# EAGLE design a210-4-band-eq (EAGLE 7.5.1)
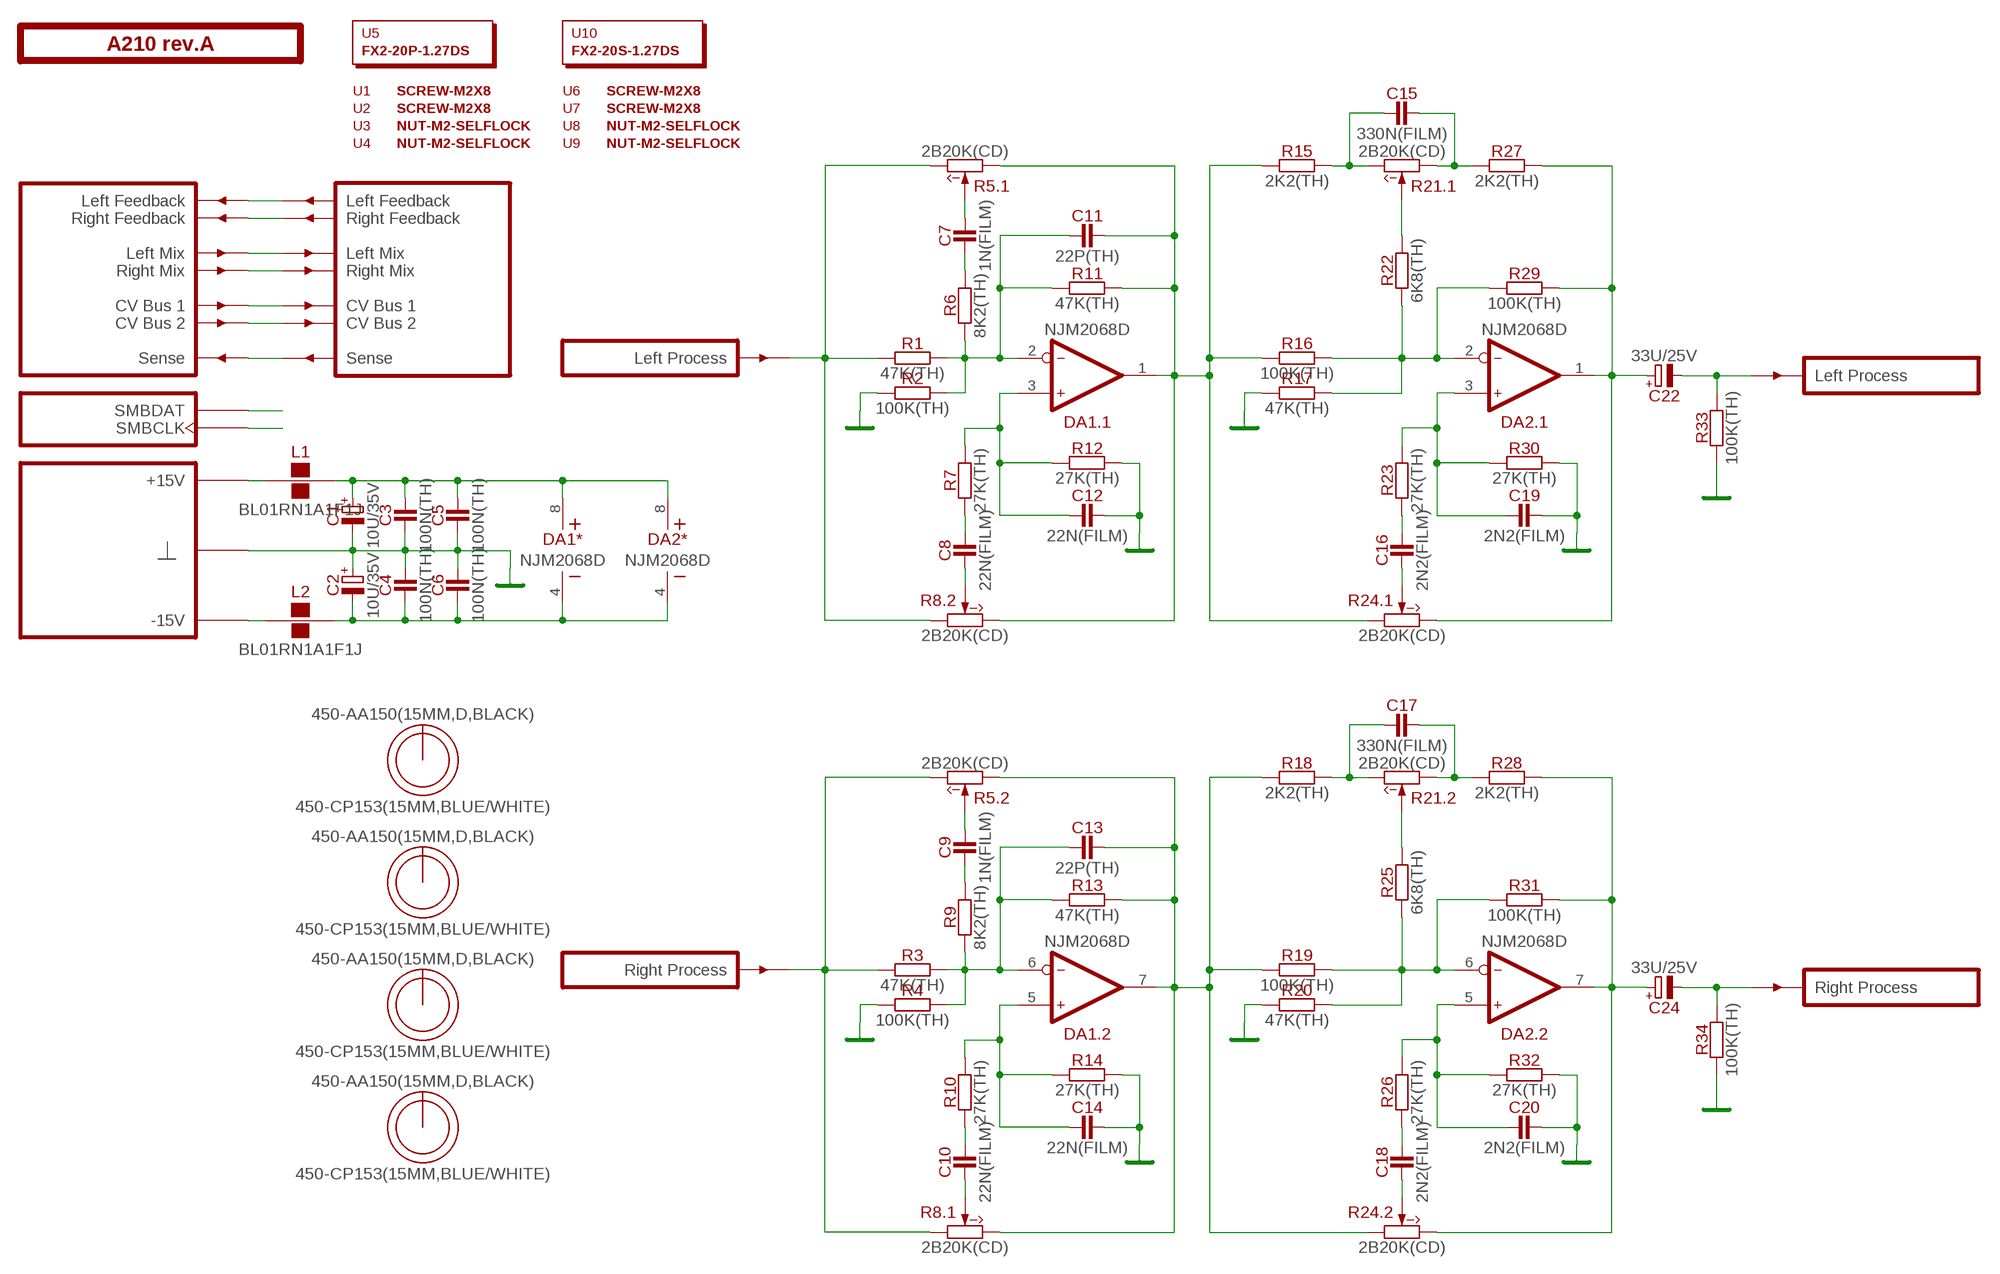
[diagram p0: schematic, sheet 1]

## Parts
C1  10U/35V  [E2-5]
C2  10U/35V  [E2-5]
C3  100N(TH)  [C050-024X044]
C4  100N(TH)  [C050-024X044]
C5  100N(TH)  [C050-024X044]
C6  100N(TH)  [C050-024X044]
C7  1N(FILM)  [C050-025X075]
C8  22N(FILM)  [C050-025X075]
C9  1N(FILM)  [C050-025X075]
C10  22N(FILM)  [C050-025X075]
C11  22P(TH)  [C050-024X044]
C12  22N(FILM)  [C050-025X075]
C13  22P(TH)  [C050-024X044]
C14  22N(FILM)  [C050-025X075]
C15  330N(FILM)  [C050-035X075]
C16  2N2(FILM)  [C050-025X075]
C17  330N(FILM)  [C050-035X075]
C18  2N2(FILM)  [C050-025X075]
C19  2N2(FILM)  [C050-025X075]
C20  2N2(FILM)  [C050-025X075]
C22  33U/25V  [E2,5-7]
C24  33U/25V  [E2,5-7]
DA1  NJM2068D  [DIP-8]
DA2  NJM2068D  [DIP-8]
L1  BL01RN1A1F1J  [BL01RN1A]
L2  BL01RN1A1F1J  [BL01RN1A]
O1  450-AA150(15MM,D,BLACK)  [EMPTY]
O2  450-AA150(15MM,D,BLACK)  [EMPTY]
O3  450-AA150(15MM,D,BLACK)  [EMPTY]
O4  450-AA150(15MM,D,BLACK)  [EMPTY]
O5  450-CP153(15MM,BLUE/WHITE)  [EMPTY]
O6  450-CP153(15MM,BLUE/WHITE)  [EMPTY]
O7  450-CP153(15MM,BLUE/WHITE)  [EMPTY]
O8  450-CP153(15MM,BLUE/WHITE)  [EMPTY]
PCB1  A210 rev.A  ST2-BOARD-50  [ST2-BOARD-50]
R1  47K(TH)  [R-0207/10]
R2  100K(TH)  [R-0207/10]
R3  47K(TH)  [R-0207/10]
R4  100K(TH)  [R-0207/10]
R5  2B20K(CD)  [RV11-DUAL]
R6  8K2(TH)  [R-0207/10]
R7  27K(TH)  [R-0207/10]
R8  2B20K(CD)  [RV11-DUAL]
R9  8K2(TH)  [R-0207/10]
R10  27K(TH)  [R-0207/10]
R11  47K(TH)  [R-0207/10]
R12  27K(TH)  [R-0207/10]
R13  47K(TH)  [R-0207/10]
R14  27K(TH)  [R-0207/10]
R15  2K2(TH)  [R-0207/10]
R16  100K(TH)  [R-0207/10]
R17  47K(TH)  [R-0207/10]
R18  2K2(TH)  [R-0207/10]
R19  100K(TH)  [R-0207/10]
R20  47K(TH)  [R-0207/10]
R21  2B20K(CD)  [RV11-DUAL]
R22  6K8(TH)  [R-0207/10]
R23  27K(TH)  [R-0207/10]
R24  2B20K(CD)  [RV11-DUAL]
R25  6K8(TH)  [R-0207/10]
R26  27K(TH)  [R-0207/10]
R27  2K2(TH)  [R-0207/10]
R28  2K2(TH)  [R-0207/10]
R29  100K(TH)  [R-0207/10]
R30  27K(TH)  [R-0207/10]
R31  100K(TH)  [R-0207/10]
R32  27K(TH)  [R-0207/10]
R33  100K(TH)  [R-0207/10]
R34  100K(TH)  [R-0207/10]
U1  SCREW-M2X8  [EMPTY]
U2  SCREW-M2X8  [EMPTY]
U3  NUT-M2-SELFLOCK  [EMPTY]
U4  NUT-M2-SELFLOCK  [EMPTY]
U5  FX2-20P-1.27DS  [EMPTY]
U6  SCREW-M2X8  [EMPTY]
U7  SCREW-M2X8  [EMPTY]
U8  NUT-M2-SELFLOCK  [EMPTY]
U9  NUT-M2-SELFLOCK  [EMPTY]
U10  FX2-20S-1.27DS  [EMPTY]

## Nets
GND: C1.- C2.+ C3.1 C4.2 C5.1 C6.2 C12.2 C14.2 C19.2 C20.2 PCB1.B4'(GND) PCB1.B4(GND) PCB1.B5'(GND) PCB1.B5(GND) PCB1.B6'(GND) PCB1.B6(GND) PCB1.B7'(GND) PCB1.B7(GND) PCB1.B8'(GND) PCB1.B8(GND) R2.1 R4.1 R12.2 R14.2 R17.1 R20.1 R30.2 R32.2 R33.1 R34.1
N$1: PCB1.ALFBK'(LFBK') PCB1.ALFBK(LFBK)
N$2: PCB1.ARFBK'(RFBK') PCB1.ARFBK(RFBK)
N$3: PCB1.ALMIX'(LMIX') PCB1.ALMIX(LMIX)
N$4: PCB1.ARMIX'(RMIX') PCB1.ARMIX(RMIX)
N$5: PCB1.ACV1'(CV1') PCB1.ACV1(CV1)
N$6: PCB1.ACV2'(CV2') PCB1.ACV2(CV2)
N$7: PCB1.BSENSE'(SENSE') PCB1.BSENSE(SENSE)
N$8: PCB1.ASMBDAT'(SMBDAT) PCB1.ASMBDAT(SMBDAT)
N$9: PCB1.ASMBCLK'(SMBCLK) PCB1.ASMBCLK(SMBCLK)
N$10: C11.1 DA1.2(.1:IN-) R1.2 R2.2 R6.1 R11.1
N$11: C11.2 DA1.1(.1:OUT) R5.1(.1:CCW) R8.3'(.2:CW) R11.2 R15.1 R16.1 R24.1(.1:CCW)
N$12: C7.1 R6.2
N$13: C7.2 R5.2(.1:W)
N$14: PCB1.BINL(INL) R1.1 R5.3(.1:CW) R8.1'(.2:CCW)
N$15: C12.1 DA1.3(.1:IN+) R7.2 R12.1
N$16: DA2.2(.1:IN-) R16.2 R17.2 R22.1 R29.1
N$17: C8.2 R7.1
N$18: C8.1 R8.2'(.2:W)
N$19: C22.+ DA2.1(.1:OUT) R24.3(.1:CW) R27.2 R29.2
N$20: C19.1 DA2.3(.1:IN+) R23.2 R30.1
N$21: C16.2 R23.1
N$22: C16.1 R24.2(.1:W)
N$23: C15.2 R21.1(.1:CCW) R27.1
N$24: C15.1 R15.2 R21.3(.1:CW)
N$25: L1.1 PCB1.A+15'(P+15V) PCB1.A+15(P+15V) PCB1.B+15'(P+15V) PCB1.B+15(P+15V)
N$26: R21.2(.1:W) R22.2
N$27: C22.- PCB1.BOUTL'(OUTL) R33.2
N$28: C13.1 DA1.6(.2:IN-) R3.2 R4.2 R9.1 R13.1
N$29: C13.2 DA1.7(.2:OUT) R5.1'(.2:CCW) R8.3(.1:CW) R13.2 R18.1 R19.1 R24.1'(.2:CCW)
N$30: C9.1 R9.2
N$31: C9.2 R5.2'(.2:W)
N$32: PCB1.BINR(INR) R3.1 R5.3'(.2:CW) R8.1(.1:CCW)
N$33: C14.1 DA1.5(.2:IN+) R10.2 R14.1
N$34: C10.2 R10.1
N$35: C10.1 R8.2(.1:W)
N$36: DA2.6(.2:IN-) R19.2 R20.2 R25.1 R31.1
N$37: C24.+ DA2.7(.2:OUT) R24.3'(.2:CW) R28.2 R31.2
N$38: C20.1 DA2.5(.2:IN+) R26.2 R32.1
N$39: C18.2 R26.1
N$40: C18.1 R24.2'(.2:W)
N$41: C17.2 R21.1'(.2:CCW) R28.1
N$42: C17.1 R18.2 R21.3'(.2:CW)
N$43: R21.2'(.2:W) R25.2
N$44: C24.- PCB1.BOUTR'(OUTR) R34.2
N$45: C1.+ C3.2 C5.2 DA1.8(*:V+) DA2.8(*:V+) L1.2
N$46: L2.1 PCB1.A-15'(P-15V) PCB1.A-15(P-15V) PCB1.B-15'(P-15V) PCB1.B-15(P-15V)
N$47: C2.- C4.1 C6.1 DA1.4(*:V-) DA2.4(*:V-) L2.2

## Library data of the parts
C1 C2 = capacitors-electrolytic:?; MOUSER: 647-USW1V100MDD
C3-C6 = capacitors:?; MOUSER: 81-RCER71H104K0A2H3B
C7 C9 C11 C13 = capacitors:?
C8 C10 C12 C14 = capacitors:?; MOUSER: 80-R82EC2220DQ50J
C15 C17 = capacitors:?; MOUSER: 505-MKS2.33/63/10
C16 C18-C20 = capacitors:?; MOUSER: 80-PHE426DJ4220JR05
C22 C24 = capacitors-electrolytic:?
DA1 DA2 = ic-jrc:NJM2068; MOUSER: 513-NJM2068D
L1 L2 = inductors:BL01RN1A?; MOUSER: 81-BL01RN1A1F1J
O1-O4 = hardware:450-AA?; MOUSER: 450-AA150
O5-O8 = hardware:450-C?; MOUSER: 450-CP153
PCB1 = module-footprints:ST2-BOARD-?
R1 R3 R6 R7 R9-R15 R17 R18 R20 R22 R23 R25-R28 R30 R32 = resistors:?
R2 R4 R16 R19 R29 R31 R33 R34 = resistors:?; MOUSER: 71-RN55D-F-100K
R5 R8 R21 R24 = potentiometers:2**?; MOUSER: 688-RK12L1230C1M
U1-U4 U6-U9 = hardware:*?
U5 = hardware:?; MOUSER: 798-FX2-20P-1.27DS71
U10 = hardware:?; MOUSER: 798-FX2-20S-1.27DS71

## Board
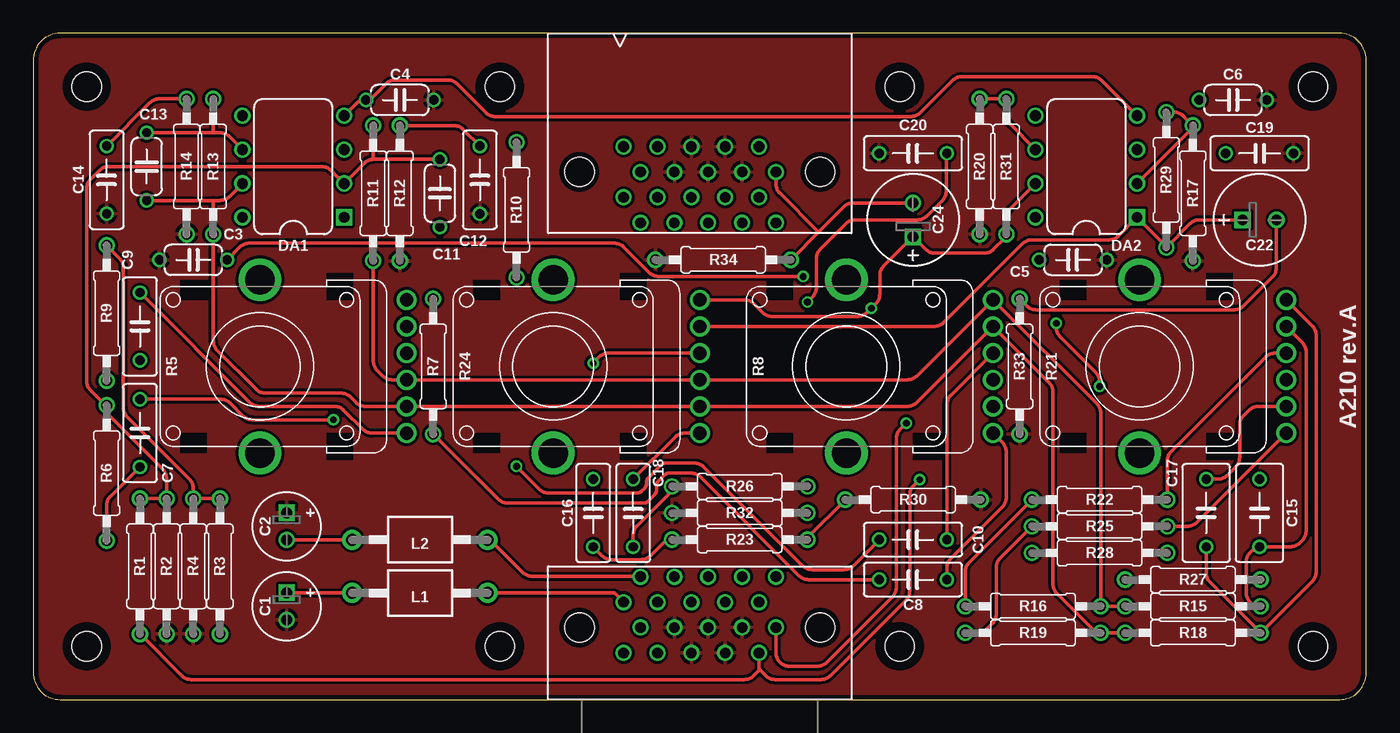
[diagram p1: board, top side]
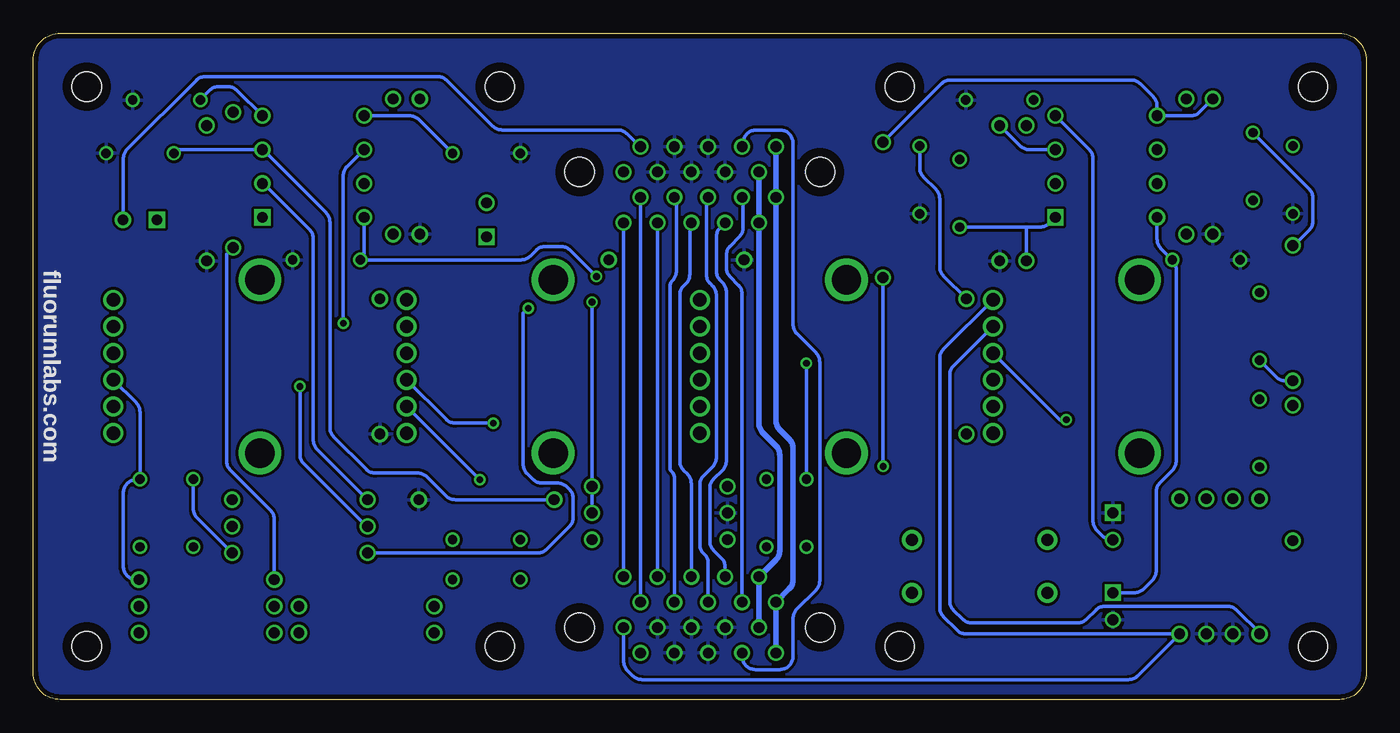
[diagram p2: board, bottom side, seen from below]

Size 100 x 50 mm. Coordinates in mm from the lower left corner, seen from the top.
Outline: 0,48 0,2 arc90 2,0 98,0 arc90 100,2 100,48 arc90 98,50 2,50 arc90 0,48
Copper layers (1*16): Top 0.0356mm / dielectric 1.5011mm / Bottom 0.0356mm
Design rules "sonictrain": minimum track width 6mil, minimum drill 13mil, track to track 8mil, track to pad 8mil, pad to pad 6mil, via to via 6mil, smd to smd 6mil, copper to edge 15mil, drill to drill 6mil, minimum pad ring 7mil, minimum via ring 7mil, stop-mask expansion 3mil, vias tented up to drill 25mil, thermal gap 10mil

### Footprints (pad centres in the part's own frame; a part is rotated, then mirrored left to right if it is on the bottom)
E2-5 = drill 0.813 square: + -1.016,0 | drill 0.813: - 1.016,0
C050-024X044 = drill 0.7: 1 -2.54,0; 2 2.54,0
C050-025X075 = drill 0.7: 1 -2.54,0; 2 2.54,0
C050-035X075 = drill 0.7: 1 -2.54,0; 2 2.54,0
E2,5-7 = drill 0.813 square: + -1.27,0 | drill 0.813: - 1.27,0
DIP-8 = drill 0.813 square: 1 -3.81,-3.81 | drill 0.813: 2 -1.27,-3.81; 3 1.27,-3.81; 4 3.81,-3.81; 5 3.81,3.81; 6 1.27,3.81; 7 -1.27,3.81; 8 -3.81,3.81
BL01RN1A = drill 0.9 pad 1.5: 1 -5.08,0; 2 5.08,0
ST2-BOARD-50 = drill 0.8: A+15 44.285,7.31; A+15' 44.285,37.69; A-15 45.555,9.215; A-15' 45.555,35.785; ACV1 51.905,7.31; ACV1' 51.905,37.69; ACV2 53.175,9.215; ACV2' 53.175,35.785; ALFBK 49.365,7.31; ALFBK' 49.365,37.69; ALMIX 46.825,7.31; ALMIX' 46.825,37.69; ARFBK 50.635,9.215; ARFBK' 50.635,35.785; ARMIX 48.095,9.215; ARMIX' 48.095,35.785; ASMBCLK 55.715,9.215; ASMBCLK' 55.715,35.785; ASMBDAT 54.445,7.31; ASMBDAT' 54.445,37.69; B4 48.095,5.405; B4' 48.095,39.595; B5 49.365,3.5; B5' 49.365,41.5; B6 50.635,5.405; B6' 50.635,39.595; B7 51.905,3.5; B7' 51.905,41.5; B8 53.175,5.405; B8' 53.175,39.595; B+15 44.285,3.5; B+15' 44.285,41.5; B-15 45.555,5.405; B-15' 45.555,39.595; BINL 54.445,3.5; BINR 55.715,5.405; BOUTL' 54.445,41.5; BOUTR' 55.715,39.595; BSENSE 46.825,3.5; BSENSE' 46.825,41.5 | hole 2.2: 4,4; 4,46; 96,4; 96,46; 35,46; 65,46; 65,4; 35,4; 59.025,5.405; 40.975,5.405; 40.975,39.595; 59.025,39.595
R-0207/10 = drill 0.813: 1 -5.08,0; 2 5.08,0
RV11-DUAL = drill 1: 1 -1,-11; 1' -3,-11; 2 1,-11; 2' -5,-11; 3 3,-11; 3' 5,-11 | drill 2.2: S1 -6.5,0; S2 6.5,0

### Placement (x,y rotation side)
C1  19,7 270 top
C2  19,13 270 top
C3  12,33 0 top
C4  27.5,45 0 top
C5  78,33 180 top
C6  90,45 0 top
C7  8,20 90 top
C8  66,9 180 top
C9  8,28 90 top
C10  66,12 180 top
C11  30.5,38 270 top
C12  33.5,39 270 top
C13  8.5,40 270 top
C14  5.5,39 270 top
C15  92,14 90 top
C16  42,14 270 top
C17  88,14 90 top
C18  45,14 270 top
C19  92,41 0 top
C20  66,41 180 top
C22  92,36 0 top
C24  66,36 90 top
DA1  19.5,40 90 top
DA2  79,40 90 top
L1  29,8 180 top
L2  29,12 180 top
O1  -8,-109.25 0 top  (outside the outline)
O2  -9,-110.5 0 top  (outside the outline)
O3  -10,-111.75 0 top  (outside the outline)
O4  -11,-113 0 top  (outside the outline)
O5  -12,-114.25 0 top  (outside the outline)
O6  -13,-115.5 0 top  (outside the outline)
O7  -14,-116.75 0 top  (outside the outline)
O8  -15,-118 0 top  (outside the outline)
PCB1  0,0 0 top
R1  8,10 90 top
R2  10,10 90 top
R3  14,10 90 top
R4  12,10 90 top
R5  2*B20K(CD)  [RV11-DUAL]  17,25 90 top
R6  5.5,17 270 top
R7  30,25 90 top
R8  2*B20K(CD)  [RV11-DUAL]  61,25 90 top
R9  5.5,29 270 top
R10  36.25,36.75 90 top
R11  25.5,38 270 top
R12  27.5,38 270 top
R13  13.5,40 270 top
R14  11.5,40 270 top
R15  87,7 0 top
R16  75,7 180 top
R17  87,38 90 top
R18  87,5 0 top
R19  75,5 180 top
R20  71,40 90 top
R21  2*B20K(CD)  [RV11-DUAL]  83,25 90 top
R22  80,15 0 top
R23  53,12 0 top
R24  2*B20K(CD)  [RV11-DUAL]  39,25 90 top
R25  80,13 0 top
R26  53,16 0 top
R27  87,9 180 top
R28  80,11 180 top
R29  85,39 270 top
R30  66,15 0 top
R31  73,40 270 top
R32  53,14 180 top
R33  74,25 90 top
R34  51.75,33 0 top
U1  34,-108 0 top  (outside the outline)
U2  37,-108 0 top  (outside the outline)
U3  46,-108 0 top  (outside the outline)
U4  49,-108 0 top  (outside the outline)
U5  28,-108 0 top  (outside the outline)
U6  40,-108 0 top  (outside the outline)
U7  43,-108 0 top  (outside the outline)
U8  52,-108 0 top  (outside the outline)
U9  55,-108 0 top  (outside the outline)
U10  31,-108 0 top  (outside the outline)

### Tracks (layer width: path | path; a pad name or v marks a point on that pad's centre or on a via)
GND
  pour Bottom: 0,0 100,0 100,50 0,50
  pour Top: 0,0 100,0 100,50 0,50
N$1
  Bottom 0.254: PCB1.ALFBK 49.37,10.2 arc-45 49.66,10.91 49.71,10.96 arc45 50,11.66 50,16.09 arc45 49.71,16.79 49.04,17.46 arc-45 48.75,18.16 48.75,30.34 arc-45 49.04,31.04 49.21,31.21 arc45 49.5,31.91 49.5,37.55 PCB1.ALFBK'
N$2
  Bottom 0.254: PCB1.ARFBK 50.63,16.22 arc-45 50.93,16.93 51.21,17.21 arc45 51.5,17.91 51.5,30.34 arc45 51.21,31.04 51.04,31.21 arc-45 50.75,31.91 50.75,35.67 PCB1.ARFBK'
N$3
  Bottom 0.254: PCB1.ALMIX 46.83,30.41 arc-45 47.12,31.12 47.71,31.71 arc45 48,32.41 48,33.34 arc45 47.71,34.04 47.04,34.71 arc-45 46.75,35.41 46.75,37.62 PCB1.ALMIX'
N$4
  Bottom 0.254: PCB1.ARMIX 48.09,9.93 arc-45 48.39,10.64 48.96,11.21 arc45 49.25,11.91 49.25,15.84 arc45 48.96,16.54 48.29,17.21 arc-45 48,17.91 48,30.59 arc-45 48.29,31.29 48.46,31.46 arc45 48.75,32.16 48.75,34.72 arc45 48.46,35.42 PCB1.ARMIX'
N$5
  Bottom 0.254: PCB1.ACV1 51.91,16.7 arc-45 52.05,17.05 52.1,17.1 arc45 52.25,17.46 52.25,30.96 arc45 52.04,31.46 arc-45 51.75,32.16 51.75,37.53 PCB1.ACV1'
N$6
  Bottom 0.254: PCB1.ACV2 PCB1.ACV2'
N$7
  Bottom 0.254: PCB1.BSENSE 46.83,3.25 arc-90 45.83,2.25 44,2.25 arc-90 43,3.25 43,6.09 arc45 42.71,6.79 41.29,8.21 arc-45 41,8.91 41,25.34 arc-45 41.29,26.04 42.71,27.46 arc45 43,28.16 43,41.75 arc-90 44,42.75 45.75,42.75 arc-90 46.75,41.75 46.75,41.58 PCB1.BSENSE'
N$8
  Bottom 0.254: PCB1.ASMBDAT' PCB1.ASMBDAT
N$9
  Bottom 0.254: PCB1.ASMBCLK PCB1.ASMBCLK'
N$10
  Top 0.254: C11.1 25.5,40.54 | 25.5,40.54 arc45 24.85,40.27 DA1.2 22.33,39.71 arc45 21.63,40 5.66,40 arc45 4.96,39.71 4.29,39.04 arc45 4,38.34 4,23.91 arc45 4.29,23.21 5.42,22.08 R6.1 5.5,21.5 9.71,17.29 arc-45 10,16.59 R2.2 R1.2 | R11.1 25.5,40.54
N$11
  Top 0.254: R15.1 R16.1 80.08,21.51 arc45 79.79,22.21 R8.3' 66.29,24.29 arc-45 65.59,24 R24.1 R5.1 26.91,24 arc-45 26.21,24.29 25.79,24.71 arc-45 25.5,25.41 R11.2
  Bottom 0.254: C11.2 25.5,35.46 | 25.5,35.46 24.45,35.46 arc-45 23.75,35.75 DA1.1 | R11.2 25.5,35.46
N$12
  Top 0.254: R6.2 5.5,14.55 arc-45 5.79,15.25 C7.1
N$13  (via drill 0.5)
  Top 0.254: C7.2 14.05,22.54 arc-45 14.75,22.25 15.71,21.29 arc45 16.41,21 v22.5,21
  Bottom 0.254: v22.5,21 23,21 R5.2
N$14  (via drill 0.5)
  Top 0.254: R1.1 11.13,1.79 arc45 11.83,1.5 53.34,1.5 arc45 54.04,1.79 54.45,2.19 PCB1.BINL 54.45,2.31 54.96,1.79 arc45 55.66,1.5 59.09,1.5 arc45 59.79,1.79 65.46,7.46 arc45 65.75,8.16 65.75,15.34 arc-45 66.04,16.04 v66.5,16.5
  Bottom 0.254: R1.1 8,5 9.71,6.71 arc-45 10.41,7 19.59,7 arc-45 20.29,6.71 20.96,6.04 arc45 21.66,5.75 29.59,5.75 arc45 30.29,6.04 30.96,6.71 arc45 31.25,7.41 31.25,24.34 arc45 30.96,25.04 R5.3 | v66.5,16.5 R8.1'
N$15
  Top 0.254: R12.1 31.55,43.08 arc-45 32.25,42.79 C12.1
  Bottom 0.254: DA1.3 25.28,41.27 arc45 25.98,41.56 R12.1 | C12.1 33.5,39.91 arc-45 33.21,39.21 32.29,38.29 arc45 32,37.59 32,32.49 arc-45 31.71,31.79 R7.2
N$16
  Top 0.254: DA2.2 87,42.92 R17.2 86.29,43.79 arc45 85.59,44.08 R29.1 | R16.2 69.92,9.59 arc-45 70.21,10.29 R22.1
  Bottom 0.254: DA2.2 82.73,38.73 79.29,35.29 arc45 79,34.59 79,19.49 arc-45 78.71,18.79 R22.1
N$17
  Top 0.254: C8.2 58.16,9 arc-45 57.46,9.29 50.04,16.71 arc45 49.34,17 47.71,17 arc45 47.35,16.85 46.9,16.4 arc45 46.75,16.04 46.75,15.71 arc-45 46.6,15.35 46.15,14.9 arc-45 45.79,14.75 35.58,14.75 arc-45 34.88,15.04 R7.1
N$18
  Top 0.254: C8.1 68.54,9.88 arc-45 68.83,10.58 72.71,14.46 arc45 73,15.16 73,18.59 arc45 72.71,19.29 R8.2'
N$19
  Top 0.254: C22.+ 87.49,36 arc45 86.79,35.71 R29.2 85,34 DA2.1 81.41,34.79 arc-45 80.71,34.5 74.91,34.5 arc45 74.21,34.21 68.29,28.29 arc-45 67.59,28 R24.3
  Bottom 0.254: R27.2 81.92,13.51 arc-45 82.21,14.21 85.21,17.21 arc45 85.5,17.91 85.5,33.42 R29.2
N$20
  Top 0.254: R23.2 58.08,12.16 R30.1
  Bottom 0.254: C19.1 89.19,41.27 DA2.3 82.77,41.27 78.04,36.54 arc45 77.75,35.84 77.75,20.41 arc-45 77.46,19.71 75.04,17.29 arc-45 74.34,17 71.16,17 arc45 70.46,16.71 69.04,15.29 arc-45 68.34,15 R30.1
N$21
  Top 0.254: R23.1 47.5,12 46.29,10.79 arc-45 45.59,10.5 43.37,10.5 arc-45 42.67,10.79 C16.2
N$22  (via drill 0.5)
  Top 0.254: R24.2 43.16,26 arc45 42.46,25.71 v42,25.25
  Bottom 0.254: v42,25.25 C16.1
N$23
  Bottom 0.254: R27.1 92.25,9 arc90 93.25,10 93.25,15.5 arc90 92.25,16.5 92.04,16.5 C15.2 92,21.59 arc-45 92.29,22.29 R21.1
N$24
  Top 0.254: R15.2 92,7 arc-90 91,8 91,10.34 arc-45 91.29,11.04 91.5,11.25 91.79,11.25 C15.1 94.3,11.46 arc45 95,11.75 95.21,11.96 arc45 95.5,12.66 95.5,26.09 arc45 95.21,26.79 R21.3
N$25
  Top 0.254: L1.1 43.59,8 PCB1.A+15
  Bottom 0.406: PCB1.B+15 PCB1.A+15 43.29,8.3 arc-45 43,9.01 43,18.84 arc-45 43.29,19.54 43.99,20.24 arc45 44.28,20.95 PCB1.A+15' PCB1.B+15'
N$26
  Top 0.254: R22.2 85.08,17.92 arc-45 85.37,18.62 92.46,25.71 arc-45 93.16,26 R21.2
N$27
  Top 0.254: C22.- 93.27,32.43 arc-45 92.98,31.73 90.79,29.54 arc-45 90.09,29.25 75.24,29.25 arc-45 74.54,29.54 R33.2
  Bottom 0.254: PCB1.BOUTL' 54.5,41.5 55.46,42.46 arc-45 56.16,42.75 64.84,42.75 arc45 65.54,43.04 68.96,46.46 arc-45 69.66,46.75 87.09,46.75 arc-45 87.79,46.46 92.96,41.29 arc-45 93.25,40.59 93.25,36.02 C22.-
N$28
  Top 0.254: C13.1 13.5,42.54 | 13.5,42.54 14.01,42.54 arc-45 14.71,42.25 DA1.6 | R13.1 13.5,42.54 | R3.2 R4.2 12,15.84 arc45 11.71,16.54 7.04,21.21 arc-45 6.75,21.91 6.75,32.42 arc45 6.46,33.12 R9.1
  Bottom 0.254: R9.1 5.42,34.08 4.29,35.21 arc-45 4,35.91 4,37.63 arc-45 4.29,38.33 C13.1
N$29
  Top 0.254: C13.2 13.5,37.46 | 13.5,37.46 14.01,37.46 arc45 14.71,37.75 DA1.7 | 13.5,37.46 R13.2 13.5,26.91 arc45 13.79,26.21 16.71,23.29 arc45 17.41,23 23.09,23 arc-45 23.79,22.71 24.21,22.29 arc45 24.91,22 R5.1' R24.1' 65.59,22 arc45 66.29,22.29 R8.3 76.21,23.79 arc-45 76.5,23.09 76.5,8.66 arc45 76.79,7.96 79.52,5.23 arc45 R19.1 R18.1
N$30
  Bottom 0.254: R9.2 6.05,23.92 arc45 6.75,24.21 C9.1
N$31
  Top 0.254: R5.2' 25.41,20 arc-45 24.71,20.29 23.29,21.71 arc45 22.59,22 16.95,22 arc-45 16.25,22.29 C9.2
N$32  (via drill 0.5)
  Top 0.254: PCB1.BINR 55.72,3.5 arc90 56.72,2.5 58.84,2.5 arc45 59.54,2.79 64.46,7.71 arc45 64.75,8.41 64.75,19.59 arc-45 65.04,20.29 v65.5,20.75
  Bottom 0.254: R5.3' 31.71,26.29 arc-45 32,25.59 32,6.91 arc-45 31.71,6.21 30.71,5.21 arc-45 30.01,4.92 R3.1 17.13,1.79 arc45 17.83,1.5 54.34,1.5 arc45 55.04,1.79 55.42,2.17 arc45 55.72,2.88 PCB1.BINR | v65.5,20.75 68.34,20.75 arc45 69.04,21.04 R8.1
N$33
  Top 0.254: R14.1 9.45,45.08 arc45 8.75,44.79 C14.1
  Bottom 0.254: R14.1 12.48,44.1 arc45 13.18,43.81 DA1.5 15.69,44.53 arc-45 15.98,45.23 16.96,46.21 arc-45 17.66,46.5 31.17,46.5 arc-45 31.87,46.21 R10.2
N$34  (via drill 0.5)
  Top 0.254: C10.2 63.46,11.96 61.54,10.04 arc-45 60.84,9.75 58.41,9.75 arc-45 57.71,10.04 50.29,17.46 arc45 49.59,17.75 47.46,17.75 arc45 47.1,17.6 46.15,16.65 arc45 46,16.29 46,16.21 arc-45 45.85,15.85 45.65,15.65 arc-45 45.29,15.5 38.66,15.5 arc-45 37.96,15.79 v36.25,17.5
  Bottom 0.254: v36.25,17.5 R10.1
N$35
  Top 0.254: C10.1 68.54,22.13 arc-45 68.83,22.83 R8.2
N$36  (via drill 0.5)
  Top 0.254: R20.2 R31.1 73,43.87 arc45 73.29,43.17 DA2.6 | R19.2 70.84,5 arc45 71.54,5.29 71.96,5.71 arc45 72.25,6.41 72.25,9.92 arc-45 72.54,10.62 R25.1 | v80,23.5 80,23.84 arc45 79.71,24.54 77.04,27.21 arc-45 76.75,27.91 v76.75,28.25
  Bottom 0.254: R25.1 75,13 79.71,17.71 arc45 80,18.41 v80,23.5 | v76.75,28.25 76.75,39.3 arc45 76.46,40 DA2.6
N$37  (via drill 0.5)
  Top 0.254: DA2.7 73.29,36.83 arc45 73,36.13 R31.2 arc-45 72.88,34.63 72.04,33.79 arc-45 71.34,33.5 67.64,33.5 arc-45 66.94,33.79 C24.+ 63.79,32.52 arc45 63.5,31.82 63.5,30.41 arc-45 63.21,29.71 v62.88,29.38 62.54,29.04 arc-45 61.84,28.75 55.41,28.75 arc-45 54.71,29.04 54.04,29.71 arc45 53.34,30 R24.3'
  Bottom 0.254: R28.2 62.16,11 arc-45 61.46,11.29 59.79,12.96 arc-45 59.5,13.66 59.5,15.09 arc-45 59.79,15.79 59.96,15.96 arc-45 60.66,16.25 61.84,16.25 arc45 62.54,16.54 62.96,16.96 arc45 63.25,17.66 63.25,29 63.12,29.12 v62.88,29.38
N$38  (via drill 0.5)
  Top 0.254: C20.1 68.5,40.96 68.5,38.16 arc-45 68.21,37.46 67.04,36.29 arc-45 66.34,36 61.66,36 arc45 60.96,35.71 59.04,33.79 arc45 58.75,33.09 58.75,30.91 arc-45 58.46,30.21 v58.08,29.83
  Bottom 0.254: DA2.5 71.76,43.81 arc45 71.06,43.52 C20.1 | v58.08,29.83 R26.2 R32.1
N$39
  Top 0.254: R26.1 arc-45 47.69,15.44 45.29,13.04 arc45 45,12.34 C18.2
N$40
  Top 0.254: R24.2' 48.87,20 arc45 48.17,19.71 C18.1
N$41
  Top 0.254: C17.2 88.88,16.54 arc45 89.58,16.83 90.21,17.46 arc45 90.5,18.16 90.5,20.59 arc-45 90.79,21.29 91.21,21.71 arc-45 91.91,22 R21.1'
  Bottom 0.254: C17.2 88,14.33 arc-45 87.71,13.63 R28.1
N$42
  Top 0.254: C17.1 88,9.49 arc45 88.29,8.79 R18.2 95.96,8.88 arc45 96.25,9.58 96.25,27.34 arc45 95.96,28.04 R21.3'
N$43
  Top 0.254: R25.2 86.59,13 arc45 87.29,13.29 R21.2'
N$44
  Top 0.254: C24.- 61.51,37.27 arc45 60.81,36.98 58.91,35.09 | 58.91,35.09 R34.2 | PCB1.BOUTR' 55.72,38.7 arc45 56.01,37.99 58.91,35.09
N$45  (via drill 0.5)
  Top 0.254: C1.+ 23.9,8.02 L1.2 | v57.75,31.75 46.91,31.75 arc-45 46.21,32.04 44.29,33.96 arc45 43.59,34.25 16.2,34.25 arc45 15.5,33.96 C3.2
  Bottom 0.254: DA1.8 15.69,34.56 arc-45 15.4,33.86 C3.2 arc45 14.25,32.3 14.25,17.91 arc45 14.54,17.21 15.46,16.29 arc-45 15.75,15.59 15.75,9.66 arc45 16.04,8.96 16.69,8.31 arc45 17.4,8.02 C1.+ | DA2.8 75.19,33.27 C5.2 63.41,33 arc-45 62.71,33.29 62.29,33.71 arc45 61.59,34 60.41,34 arc45 59.71,33.71 v57.75,31.75
N$46
  Top 0.254: L2.1 34.25,12 36.71,9.54 arc45 37.41,9.25 45.52,9.25 PCB1.A-15
  Bottom 0.406: PCB1.B-15 PCB1.A-15 44.29,10.48 arc-45 44,11.18 44,18.34 arc-45 44.29,19.04 45.26,20.01 arc45 45.55,20.72 PCB1.A-15' PCB1.B-15'
N$47
  Top 0.254: DA1.4 24.21,44.71 arc-45 24.91,45 C4.1 arc45 25.45,45.2 26.46,46.21 arc-45 27.16,46.5 31.09,46.5 arc-45 31.79,46.21 33.96,44.04 arc45 34.66,43.75 65.84,43.75 arc45 66.54,44.04 68.96,46.46 arc-45 69.66,46.75 79.46,46.75 arc-45 80.16,46.46 DA2.4 | L2.2 19.02,12 C2.-
  Bottom 0.254: C6.1 87.46,45.04 86.79,45.71 arc45 86.09,46 85.41,46 arc45 84.71,45.71 DA2.4 | C2.- 19.07,11.98 arc45 19.78,12.28 20.21,12.71 arc45 20.5,13.41 20.5,40.59 arc-45 20.79,41.29 DA1.4